# EAGLE design Irrigation V1.0 (EAGLE 5.10)
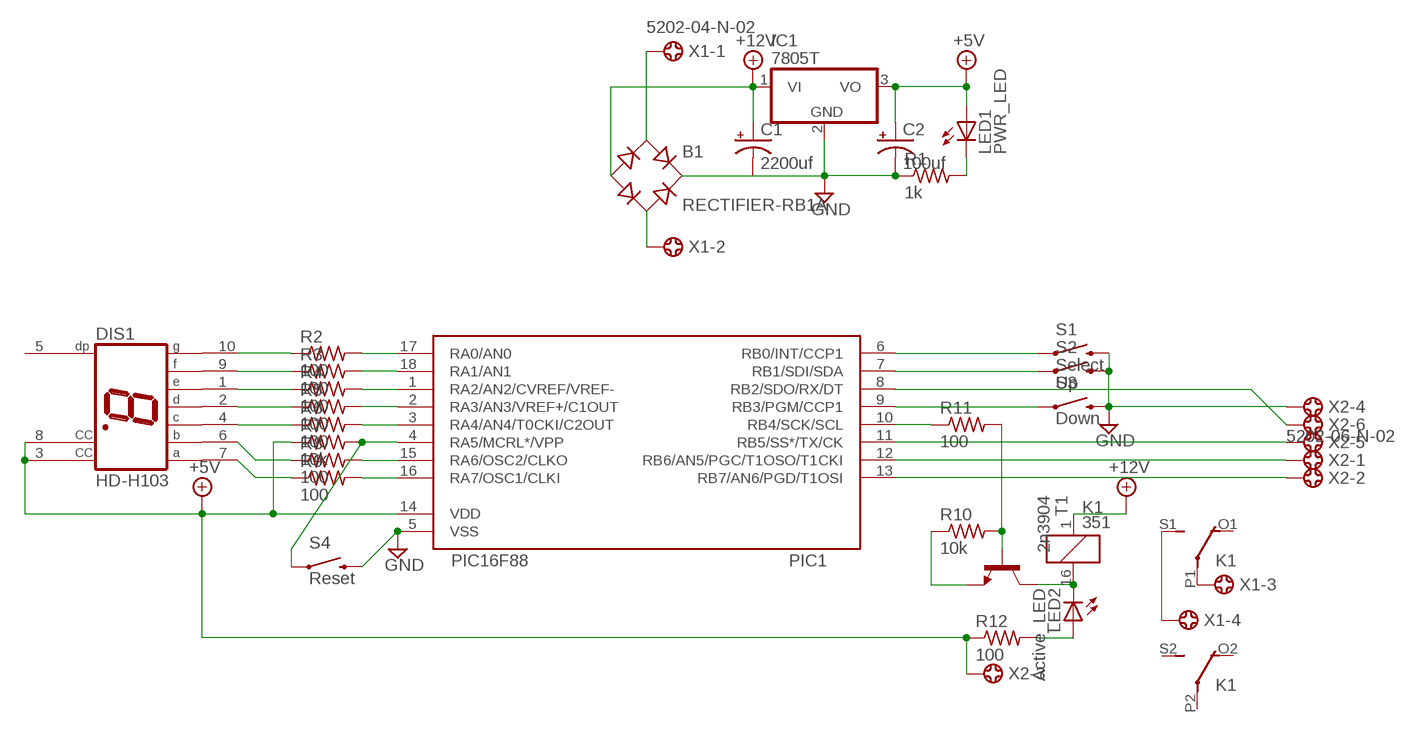
[diagram p0: schematic, sheet 1]

## Parts
B1  RECTIFIER-RB1A  [RB1A]
C1  2200uf  CPOL-USE7.5-16  [E7,5-16]
C2  100uf  CPOL-USE2.5-5  [E2,5-5]
DIS1  HD-H103  [HDSP-M]
IC1  7805T  [TO220H]
K1  351  [351]
LED1  PWR_LED  LED3MM  [LED3MM]
LED2  Active_LED  LED3MM  [LED3MM]
PIC1  PIC16F88  [DIL18]
R1  1k  R-US_0207/10  [0207/10]
R2  100  R-US_0207/10  [0207/10]
R3  100  R-US_0207/10  [0207/10]
R4  100  R-US_0207/10  [0207/10]
R5  100  R-US_0207/10  [0207/10]
R6  100  R-US_0207/10  [0207/10]
R7  10k  R-US_0207/10  [0207/10]
R8  100  R-US_0207/10  [0207/10]
R9  100  R-US_0207/10  [0207/10]
R10  10k  R-US_0207/10  [0207/10]
R11  100  R-US_0207/10  [0207/10]
R12  100  R-US_0207/10  [0207/10]
S1  Select  SWITCH-MOMENTARY-2PTH  [TACTILE-PTH]
S2  Up  SWITCH-MOMENTARY-2PTH  [TACTILE-PTH]
S3  Down  SWITCH-MOMENTARY-2PTH  [TACTILE-PTH]
S4  Reset  SWITCH-MOMENTARY-2PTH  [TACTILE-PTH]
T1  2n3904  -NPN-TO92-E1  [TO92-E1]
X1  5202-04-N-02  [5202-04-N-02]
X2  5202-06-N-02  [5202-06-N-02]

## Nets
+5V: C2.+ DIS1.3(CC) DIS1.8(CC) IC1.3(VO) LED1.A PIC1.14(VDD) R7.1 R12.1 X2.3
+12V: B1.- C1.+ IC1.1(VI) K1.1
GND: B1.+ C1.- C2.- IC1.2(GND) PIC1.5(VSS) R1.1 S1.3 S2.3 S3.3 S4.3 X2.4
N$1: B1.AC2 X1.2
N$2: LED1.K(C) R1.2
N$3: DIS1.10(G) R2.1
N$4: PIC1.17(RA0/AN0) R2.2
N$5: DIS1.9(F) R3.1
N$6: DIS1.1(E) R4.1
N$7: DIS1.2(D) R5.1
N$8: DIS1.4(C) R6.1
N$9: DIS1.6(B) R8.1
N$10: DIS1.7(A) R9.1
N$11: PIC1.15(RA6/OSC2/CLKO) R8.2
N$12: PIC1.4(RA5/MCRL*/VPP) R7.2 S4.1
N$13: PIC1.3(RA4/AN4/T0CKI/C2OUT) R6.2
N$14: PIC1.2(RA3/AN3/VREF+/C1OUT) R5.2
N$15: PIC1.1(RA2/AN2/CVREF/VREF-) R4.2
N$16: PIC1.18(RA1/AN1) R3.2
N$17: PIC1.16(RA7/OSC1/CLKI) R9.2
N$18: PIC1.6(RB0/INT/CCP1) S1.1
N$19: PIC1.7(RB1/SDI/SDA) S2.1
N$20: PIC1.9(RB3/PGM/CCP1) S3.1
N$21: PIC1.10(RB4/SCK/SCL) R11.1
N$22: R10.2 R11.2 T1.2(B)
N$23: R10.1 T1.3(E)
N$24: K1.16 LED2.K(C) T1.1(C)
N$25: LED2.A R12.2
N$26: B1.AC1 X1.1
N$27: K1.P1(2:P) X1.3
N$28: K1.S1(2:S) X1.4
N$29: PIC1.12(RB6/AN5/PGC/T1OSO/T1CKI) X2.1
N$30: PIC1.13(RB7/AN6/PGD/T1OSI) X2.2
N$31: PIC1.11(RB5/SS*/TX/CK) X2.5
N$32: PIC1.8(RB2/SDO/RX/DT) X2.6
Unconnected: DIS1.5(DP) K1.O1(2:O) K1.O2(3:O) K1.P2(3:P) K1.S2(3:S)

## Library data of the parts
B1 = rectifier:RECTIFIER-: Rectifier
C1 C2 = rcl:CPOL-US: POLARIZED CAPACITOR, American symbol
DIS1 = display-hp:HD-H103: LED DISPLAY 1-character 7 segment, decimal point right
IC1 = linear:78*: Positive VOLTAGE REGULATOR Source: http://cache.national.com/ds/LM/LM78L05.pdf http://www.fairchildsemi.com/ds/LM/LM7805.pdf
K1 = relay:351: RELAY 2 x switch, Omron
LED1 LED2 = led:LED: LED OSRAM: - CHIPLED LG R971, LG N971, LY N971, LG Q971, LY Q971, LO R971, LY R971 LH N974, LH R974 LS Q976, LO Q976, LY Q976 LO Q996 - Hyper CHIPLED LW Q18S LB Q993, LB Q99A, LB R99A - SideLED LS A670, LO A670, LY A670, LG A670, LP A670 LB A673, LV A673, LT A673, LW A673 LH A674 LY A675 LS A676, LA A676, LO A676, LY A676, LW A676 LS A679, LY A679, LG A679 - Hyper Micro SIDELED® LS Y876, LA Y876, LO Y876, LY Y876 LT Y87S - SmartLED LW L88C, LW L88S LB L89C, LB L89S, LG L890 LS L89K, LO L89K, LY L89K LS L896, LA L896, LO L896, LY L896 - TOPLED LS T670, LO T670, LY T670, LG T670, LP T670 LSG T670, LSP T670, LSY T670, LOP T670, LYG T670 LG T671, LOG T671, LSG T671 LB T673, LV T673, LT T673, LW T673 LH T674 LS T676, LA T676, LO T676, LY T676, LB T676, LH T676, LSB T676, LW T676 LB T67C, LV T67C, LT T67C, LS T67K, LO T67K, LY T67K, LW E67C LS E67B, LA E67B, LO E67B, LY E67B, LB E67C, LV E67C, LT E67C LW T67C LS T679, LY T679, LG T679 LS T770, LO T770, LY T770, LG T770, LP T770 LB T773, LV T773, LT T773, LW T773 LH T774 LS E675, LA E675, LY E675, LS T675 LS T776, LA T776, LO T776, LY T776, LB T776 LHGB T686 LT T68C, LB T68C - Hyper Mini TOPLED® LB M676 - Mini TOPLED Santana® LG M470 LS M47K, LO M47K, LY M47K Source: http://www.osram.convergy.de LUXEON: - LUMILED® LXK2-PW12-R00, LXK2-PW12-S00, LXK2-PW14-U00, LXK2-PW14-V00 LXK2-PM12-R00, LXK2-PM12-S00, LXK2-PM14-U00 LXK2-PE12-Q00, LXK2-PE12-R00, LXK2-PE12-S00, LXK2-PE14-T00, LXK2-PE14-U00 LXK2-PB12-K00, LXK2-PB12-L00, LXK2-PB12-M00, LXK2-PB14-N00, LXK2-PB14-P00, LXK2-PB14-Q00 LXK2-PR12-L00, LXK2-PR12-M00, LXK2-PR14-Q00, LXK2-PR14-R00 LXK2-PD12-Q00, LXK2-PD12-R00, LXK2-PD12-S00 LXK2-PH12-R00, LXK2-PH12-S00 LXK2-PL12-P00, LXK2-PL12-Q00, LXK2-PL12-R00 Source: www.luxeon.com KINGBRIGHT: KA-3528ASYC Source: www.kingbright.com
PIC1 = pic16f88-v0.1:PIC16F88
R1-R12 = resistor:R-US_: RESISTOR, American symbol
S1-S4 = SparkFun:SWITCH-MOMENTARY-2
T1 = transistor-neu-to92:*-NPN-: NPN Transistror
X1 = con-ebyelectro:5202-04-N-02: Barrier Blocks Sreies 5202 Source: http://www.ebyelectro.com/PDF/5202-XX-N-02.pdf
X2 = con-ebyelectro:5202-06-N-02: Barrier Blocks Sreies 5202 Source: http://www.ebyelectro.com/PDF/5202-XX-N-02.pdf

## Board
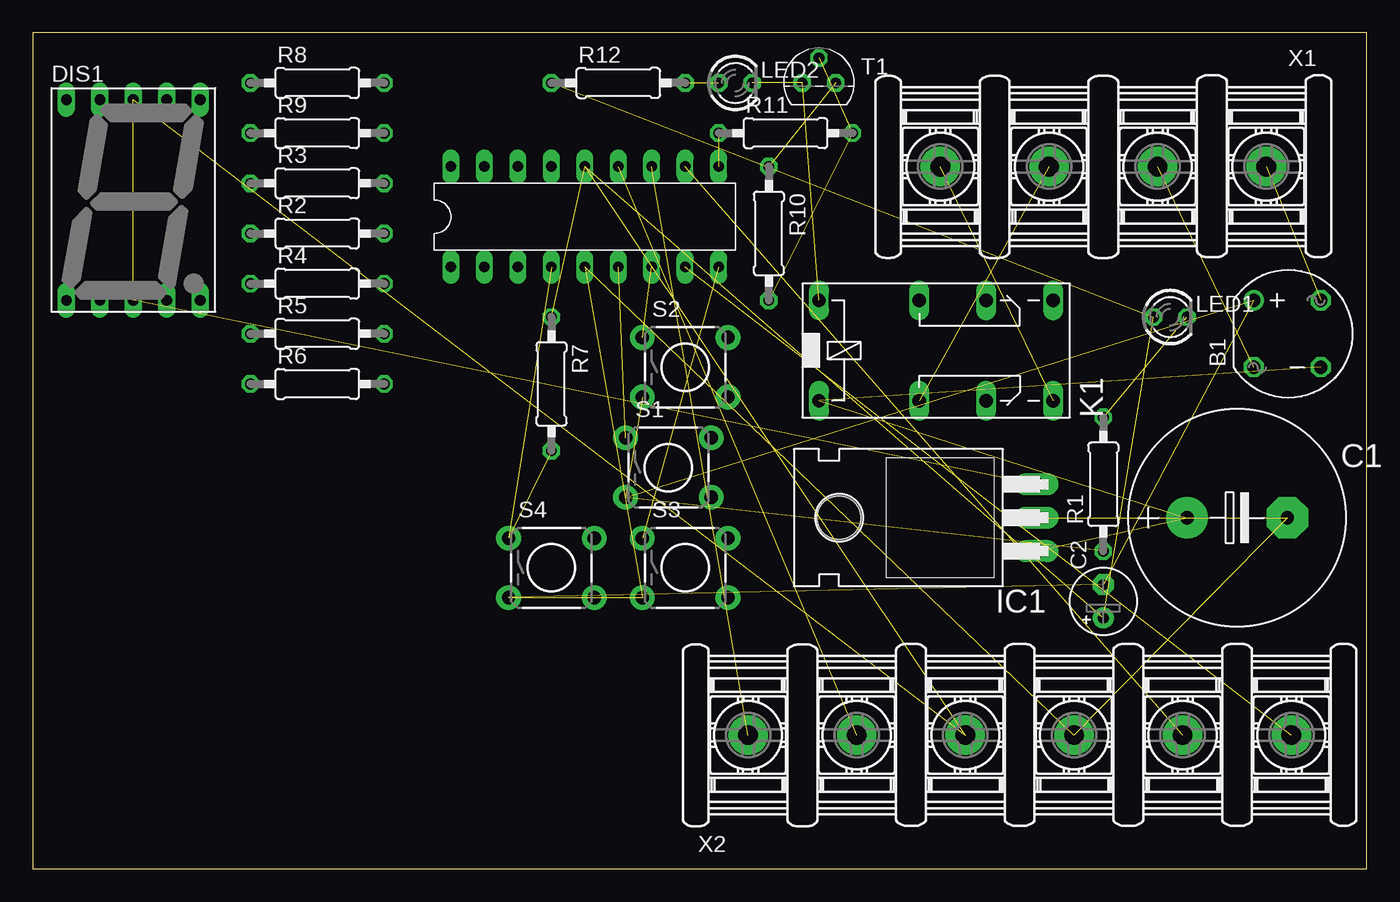
[diagram p1: board, top side]
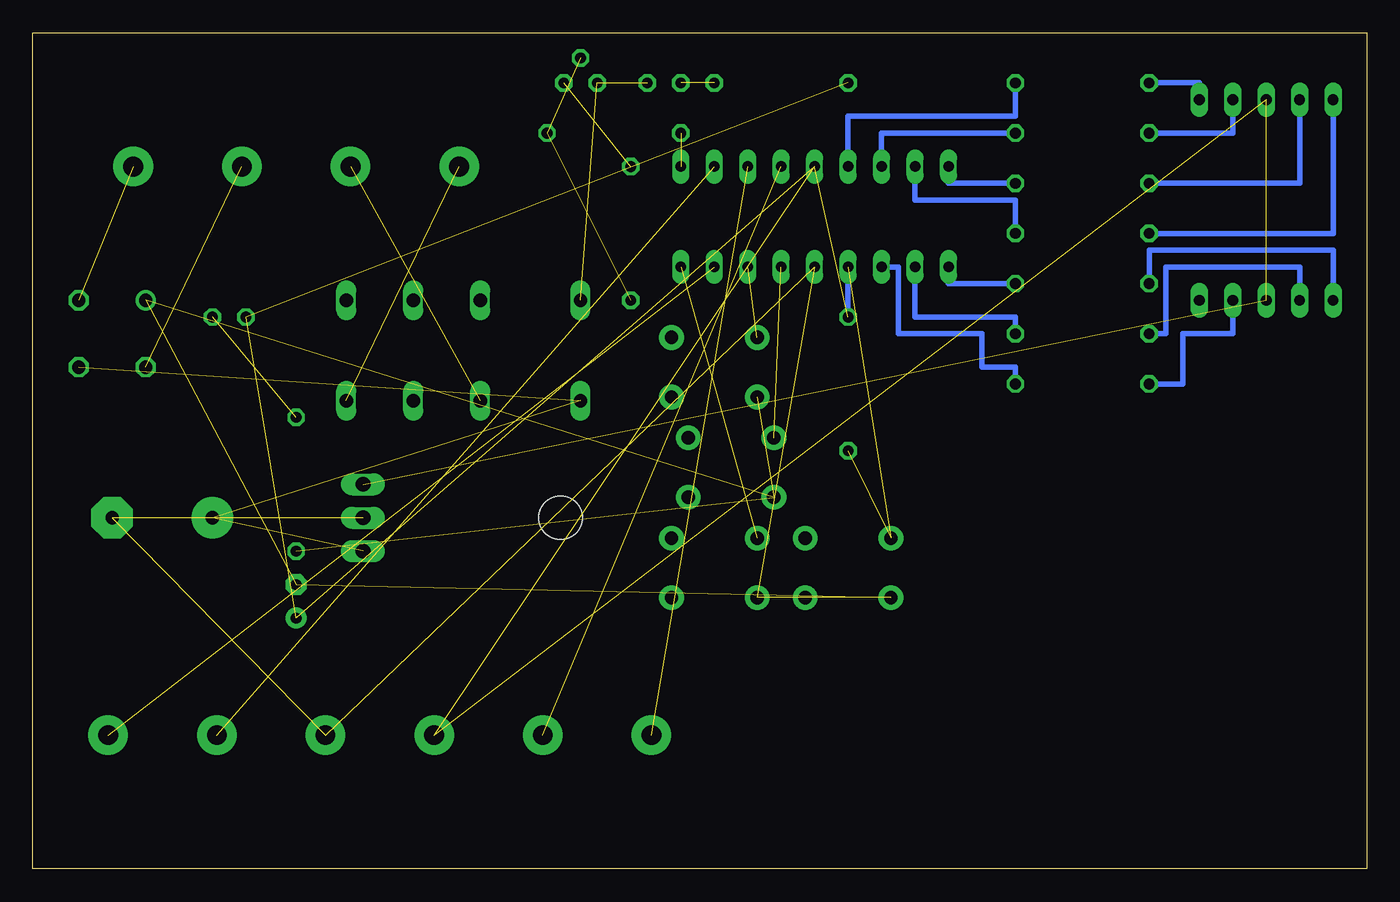
[diagram p2: board, bottom side, seen from below]

Size 101.27 x 63.49 mm. Coordinates in mm from the lower left corner, seen from the top.
Outline: 0,0 101.27,0 101.27,63.49 0,63.49 0,0
Copper layers (1*16): Top 0.035mm / dielectric 1.5mm / Bottom 0.035mm
Design rules "default": minimum track width 10mil, minimum drill 24mil, track to track 8mil, track to pad 8mil, pad to pad 8mil, via to via 8mil, smd to smd 8mil, copper to edge 40mil, drill to drill 8mil, minimum pad ring 10mil, minimum via ring 8mil, stop-mask expansion 4mil, vias tented up to drill 0mil, thermal gap 10mil

### Footprints (pad centres in the part's own frame; a part is rotated, then mirrored left to right if it is on the bottom)
RB1A = drill 1.016 round: + -2.54,2.54 | drill 1.016 octagon: - 2.54,-2.54; AC1 2.54,2.54; AC2 -2.54,-2.54
E7,5-16 = drill 1.016 pad 3.15 round: + -3.81,0 | drill 1.016 pad 3.15 octagon: - 3.81,0
E2,5-5 = drill 0.813 pad 1.6 round: + -1.27,0 | drill 0.813 pad 1.6 octagon: - 1.27,0
HDSP-M = drill 0.813 long: 1 -5.08,-7.62; 2 -2.54,-7.62; 3 0,-7.62; 4 2.54,-7.62; 5 5.08,-7.62; 6 5.08,7.62; 7 2.54,7.62; 8 0,7.62; 9 -2.54,7.62; 10 -5.08,7.62
TO220H = drill 1.118 long: 1 -2.54,-10.16; 2 0,-10.16; 3 2.54,-10.16 | hole 3.302: 0,4.826
351 = drill 1.016 long: 1 -3.81,-3.81; 16 -3.81,3.81; O1 8.89,-3.81; O2 8.89,3.81; P1 3.81,-3.81; P2 3.81,3.81; S1 13.97,-3.81; S2 13.97,3.81
LED3MM = drill 0.813 octagon: A -1.27,0; K 1.27,0
DIL18 = drill 0.8 long: 1 -15.24,0; 2 -12.7,0; 3 -10.16,0; 4 -7.62,0; 5 -5.08,0; 6 -2.54,0; 7 0,0; 8 2.54,0; 9 5.08,0; 10 5.08,7.62; 11 2.54,7.62; 12 0,7.62; 13 -2.54,7.62; 14 -5.08,7.62; 15 -7.62,7.62; 16 -10.16,7.62; 17 -12.7,7.62; 18 -15.24,7.62
0207/10 = drill 0.813 octagon: 1 -5.08,0; 2 5.08,0
TACTILE-PTH = drill 1.016 pad 1.88 round: 1 -3.251,2.261; 2 3.251,2.261; 3 -3.251,-2.261; 4 3.251,-2.261
TO92-E1 = drill 0.813 octagon: 1 -1.27,0; 2 0,1.905; 3 1.27,0
5202-04-N-02 = drill 1.5 pad 3 round: 1 -12.375,0; 2 -4.125,0; 3 4.125,0; 4 12.375,0
5202-06-N-02 = drill 1.5 pad 3 round: 1 -20.625,0; 2 -12.375,0; 3 -4.125,0; 4 4.125,0; 5 12.375,0; 6 20.625,0

### Placement (x,y rotation side)
B1  95.25,40.64 0 top
C1  91.44,26.67 0 top
C2  81.28,20.32 90 top
DIS1  7.62,50.8 0 top
IC1  66.04,26.67 90 top
K1  63.5,39.37 0 top
LED1  86.36,41.91 0 top
LED2  53.34,59.69 0 top
PIC1  46.99,45.72 0 top
R1  81.28,29.21 90 top
R2  21.59,48.26 0 top
R3  21.59,52.07 0 top
R4  21.59,44.45 0 top
R5  21.59,40.64 0 top
R6  21.59,36.83 0 top
R7  39.37,36.83 270 top
R8  21.59,59.69 0 top
R9  21.59,55.88 0 top
R10  55.88,48.26 270 top
R11  57.15,55.88 0 top
R12  44.45,59.69 0 top
S1  48.26,30.48 0 top
S2  49.53,38.1 0 top
S3  49.53,22.86 0 top
S4  39.37,22.86 0 top
T1  59.69,59.69 0 top
X1  81.28,53.34 180 top
X2  74.93,10.16 0 top

### Tracks (layer width: path | path; a pad name or v marks a point on that pad's centre or on a via)
+5V  (8 unrouted)
  Bottom 0.406: R7.1 39.37,45.72
+12V  (3 unrouted)
GND  (10 unrouted)
N$1  (1 unrouted)
N$2  (1 unrouted)
N$3
  Bottom 0.406: R2.1 2.54,48.26 DIS1.10
N$4
  Bottom 0.406: R2.2 26.67,50.8 34.29,50.8 PIC1.17
N$5
  Bottom 0.406: R3.1 5.08,52.07 DIS1.9
N$6
  Bottom 0.406: R4.1 16.51,46.99 2.54,46.99 DIS1.1
N$7
  Bottom 0.406: R5.1 15.24,40.64 15.24,45.72 5.08,45.72 DIS1.2
N$8
  Bottom 0.406: R6.1 13.97,36.83 13.97,40.64 10.16,40.64 DIS1.4
N$9
  Bottom 0.406: R8.1 12.7,59.69 DIS1.6
N$10
  Bottom 0.406: R9.1 10.16,55.88 DIS1.7
N$11
  Bottom 0.406: R8.2 26.67,57.15 39.37,57.15 PIC1.15
N$12  (2 unrouted)
N$13
  Bottom 0.406: R6.2 26.67,38.1 29.21,38.1 29.21,40.64 35.56,40.64 35.56,45.72 PIC1.3
N$14
  Bottom 0.406: R5.2 26.67,41.91 34.29,41.91 PIC1.2
N$15
  Bottom 0.406: R4.2 31.75,44.45 PIC1.1
N$16
  Bottom 0.406: R3.2 31.75,52.07 PIC1.18
N$17
  Bottom 0.406: R9.2 36.83,55.88 PIC1.16
N$18  (1 unrouted)
N$19  (1 unrouted)
N$20  (1 unrouted)
N$21  (1 unrouted)
N$22  (2 unrouted)
N$23  (1 unrouted)
N$24  (2 unrouted)
N$25  (1 unrouted)
N$26  (1 unrouted)
N$27  (1 unrouted)
N$28  (1 unrouted)
N$29  (1 unrouted)
N$30  (1 unrouted)
N$31  (1 unrouted)
N$32  (1 unrouted)